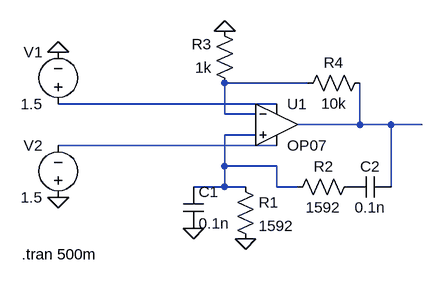
[diagram p0: schematic Quadrature Osc_Self2.asc]
Quadrature Osc_Self2.asc, the LTspice schematic file:
Version 4
SHEET 1 880 680
WIRE 256 96 128 96
WIRE 208 128 -128 128
WIRE 128 144 128 96
WIRE 176 144 128 144
WIRE 336 160 336 96
WIRE 336 160 240 160
WIRE 384 160 336 160
WIRE 432 160 384 160
WIRE 176 176 128 176
WIRE 208 192 -128 192
WIRE 128 224 128 176
WIRE 208 224 128 224
WIRE 128 256 128 224
WIRE 128 256 80 256
WIRE 160 256 128 256
WIRE 208 256 208 224
WIRE 240 256 208 256
WIRE 384 256 384 160
FLAG 128 16 0
FLAG 80 320 0
FLAG 160 336 0
FLAG -128 48 0
FLAG -128 272 0
SYMBOL OpAmps\\OP07 208 96 R0
SYMATTR InstName U1
SYMBOL cap 64 256 R0
SYMATTR InstName C1
SYMATTR Value 0.1n
SYMBOL cap 384 240 R90
WINDOW 0 0 32 VBottom 2
WINDOW 3 32 32 VTop 2
SYMATTR InstName C2
SYMATTR Value 0.1n
SYMBOL res 144 240 R0
SYMATTR InstName R1
SYMATTR Value 1592
SYMBOL res 336 240 R90
WINDOW 0 0 56 VBottom 2
WINDOW 3 32 56 VTop 2
SYMATTR InstName R2
SYMATTR Value 1592
SYMBOL res 144 112 R180
WINDOW 0 36 76 Left 2
WINDOW 3 36 40 Left 2
SYMATTR InstName R3
SYMATTR Value 1k
SYMBOL res 240 112 R270
WINDOW 0 32 56 VTop 2
WINDOW 3 0 56 VBottom 2
SYMATTR InstName R4
SYMATTR Value 10k
SYMBOL voltage -128 144 R180
WINDOW 0 24 96 Left 2
WINDOW 3 24 16 Left 2
WINDOW 123 0 0 Left 0
WINDOW 39 0 0 Left 0
SYMATTR InstName V1
SYMATTR Value 1.5
SYMBOL voltage -128 288 R180
WINDOW 0 24 96 Left 2
WINDOW 3 24 16 Left 2
WINDOW 123 0 0 Left 0
WINDOW 39 0 0 Left 0
SYMATTR InstName V2
SYMATTR Value 1.5
TEXT -184 360 Left 2 !.tran 500m

The netlist it stands for:
* Quadrature Osc_Self2.asc
XU1 N004 N001 N002 N005 N003 LT1001  ; OP07, pins In+ In- V+ V- OUT
C1 N004 0 0.1n
C2 N003 P001 0.1n
R1 N004 0 1592
R2 P001 N004 1592
R3 N001 0 1k
R4 N001 N003 10k
V1 N002 0 1.5
V2 0 N005 1.5
.tran 500m
.lib LTC.lib
.backanno
.end